# EAGLE design VSWR_meter1 (EAGLE 7.1.0)
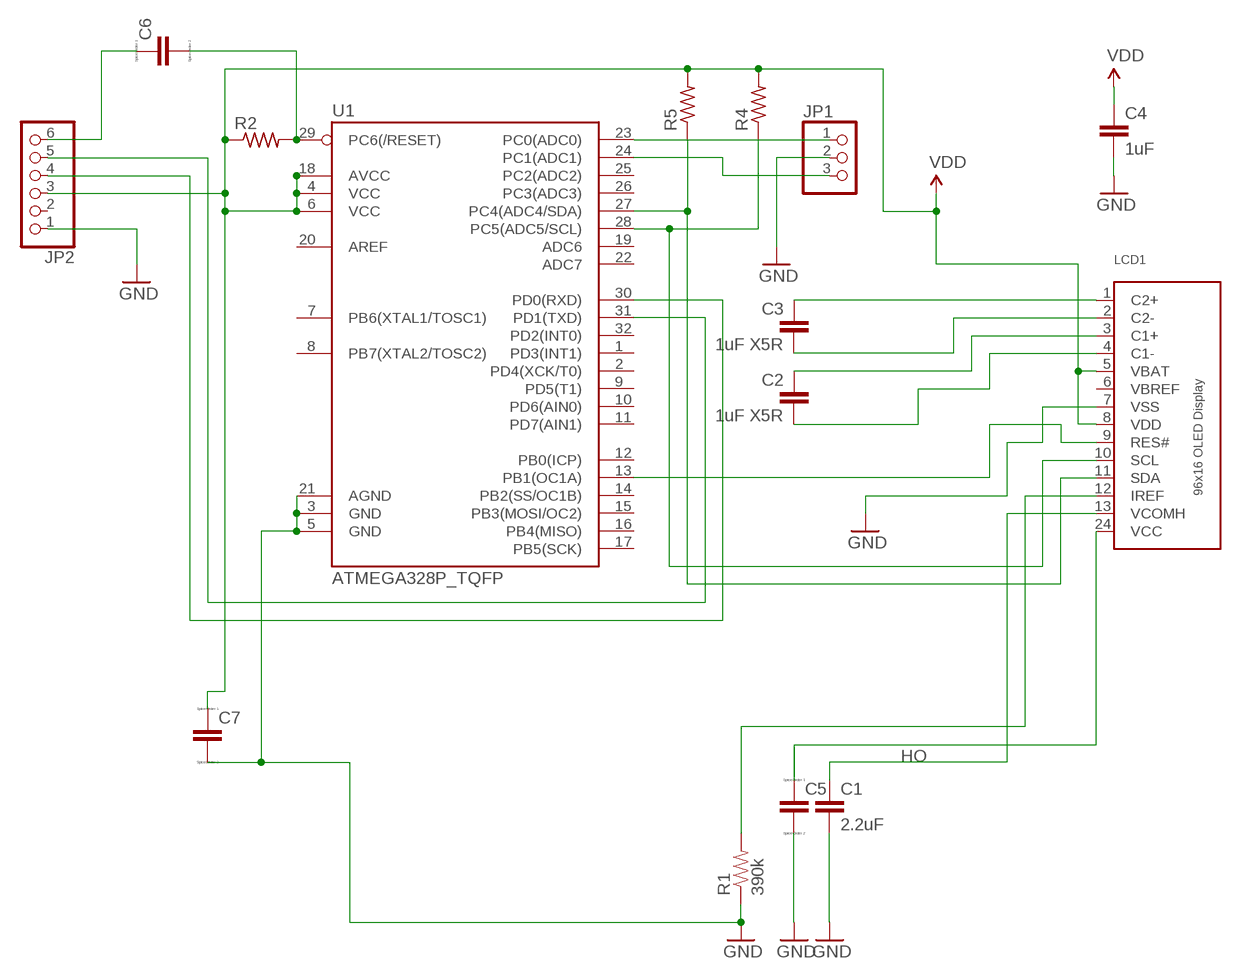
[diagram p0: schematic, sheet 1]

## Parts
C1  2.2uF  CAP0805  [0805]
C2  1uF X5R  CAP0805  [0805]
C3  1uF X5R  CAP0805  [0805]
C4  1uF  CAP0603-CAP  [0603-CAP]
C5  CC0603  [C0603]
C6  CC0603  [C0603]
C7  CC0603  [C0603]
JP1  HEADER-1X3  [1X03_OVAL]
JP2  HEADER-1X6  [1X06_OVAL]
LCD1  DISP_OLED_UG-9616GLBBG02  [UG-9616GLBBG02_0.65MM_WRAPAROUND]
R1  390k  RESISTOR0603-RES  [0603-RES]
R2  R-US_R0603  [R0603]
R4  R-US_R0603  [R0603]
R5  R-US_R0603  [R0603]
U1  ATMEGA328P_TQFP  [TQFP32-08]

## Nets
C1N: C2.2 LCD1.4(C1-)
C1P: C2.1 LCD1.3(C1+)
C2N: C3.2 LCD1.2(C2-)
C2P: C3.1 LCD1.1(C2+)
GND: C1.2 C4.2 C5.2 C7.2 JP1.2 JP2.1 LCD1.7(VSS) R1.1 U1.3(GND) U1.5(GND) U1.21(AGND)
HO: C1.1 LCD1.13(VCOMH)
IREF: LCD1.12(IREF) R1.2
N$1: LCD1.11(SDA) R5.1 U1.27(PC4(ADC4/SDA))
N$2: C6.2 R2.2 U1.29(PC6(/RESET))
N$3: LCD1.9(RES#) U1.13(PB1(OC1A))
N$4: C6.1 JP2.6
N$5: JP1.1 U1.23(PC0(ADC0))
N$6: LCD1.10(SCL) R4.1 U1.28(PC5(ADC5/SCL))
N$7: JP1.3 U1.24(PC1(ADC1))
N$8: JP2.5 U1.31(PD1(TXD))
N$9: JP2.4 U1.30(PD0(RXD))
VCOMH: C5.1 LCD1.24(VCC)
VDD: C4.1 C7.1 JP2.3 LCD1.5(VBAT) LCD1.8(VDD) R2.1 R4.2 R5.2 U1.4(VCC) U1.6(VCC) U1.18(AVCC)
Unconnected: JP2.2 LCD1.6(VBREF) U1.1(PD3(INT1)) U1.2(PD4(XCK/T0)) U1.7(PB6(XTAL1/TOSC1)) U1.8(PB7(XTAL2/TOSC2)) U1.9(PD5(T1)) U1.10(PD6(AIN0)) U1.11(PD7(AIN1)) U1.12(PB0(ICP)) U1.14(PB2(SS/OC1B)) U1.15(PB3(MOSI/OC2)) U1.16(PB4(MISO)) U1.17(PB5(SCK)) U1.19(ADC6) U1.20(AREF) U1.22(ADC7) U1.25(PC2(ADC2)) U1.26(PC3(ADC3)) U1.32(PD2(INT0))

## Library data of the parts
C1-C4 = SparkFun-Passives:CAP: Capacitor Standard 0603 ceramic capacitor, and 0.1" leaded capacitor.
C5-C7 = eagle-ltspice:C: CAPACITOR, European symbol; SPICEMODEL: NONE; SPICEPREFIX: C
JP1 = OLED_mod:HEADER-1X3: PIN HEADER
JP2 = OLED_mod:HEADER-1X6: PIN HEADER
LCD1 = OLED_mod:DISP_OLED_UG-9616GLBBG02: 96x16 0.84" I2C Mono OLED Display
R1 = SparkFun-Passives:RESISTOR: Resistor Basic schematic elements and footprints for 0603, 1206, and PTH resistors.
R2 R4 R5 = resistor:R-US_: RESISTOR, American symbol
U1 = SparkFun-DigitalIC:ATMEGA328P_TQFP; PROD_ID: IC-09069

## Board
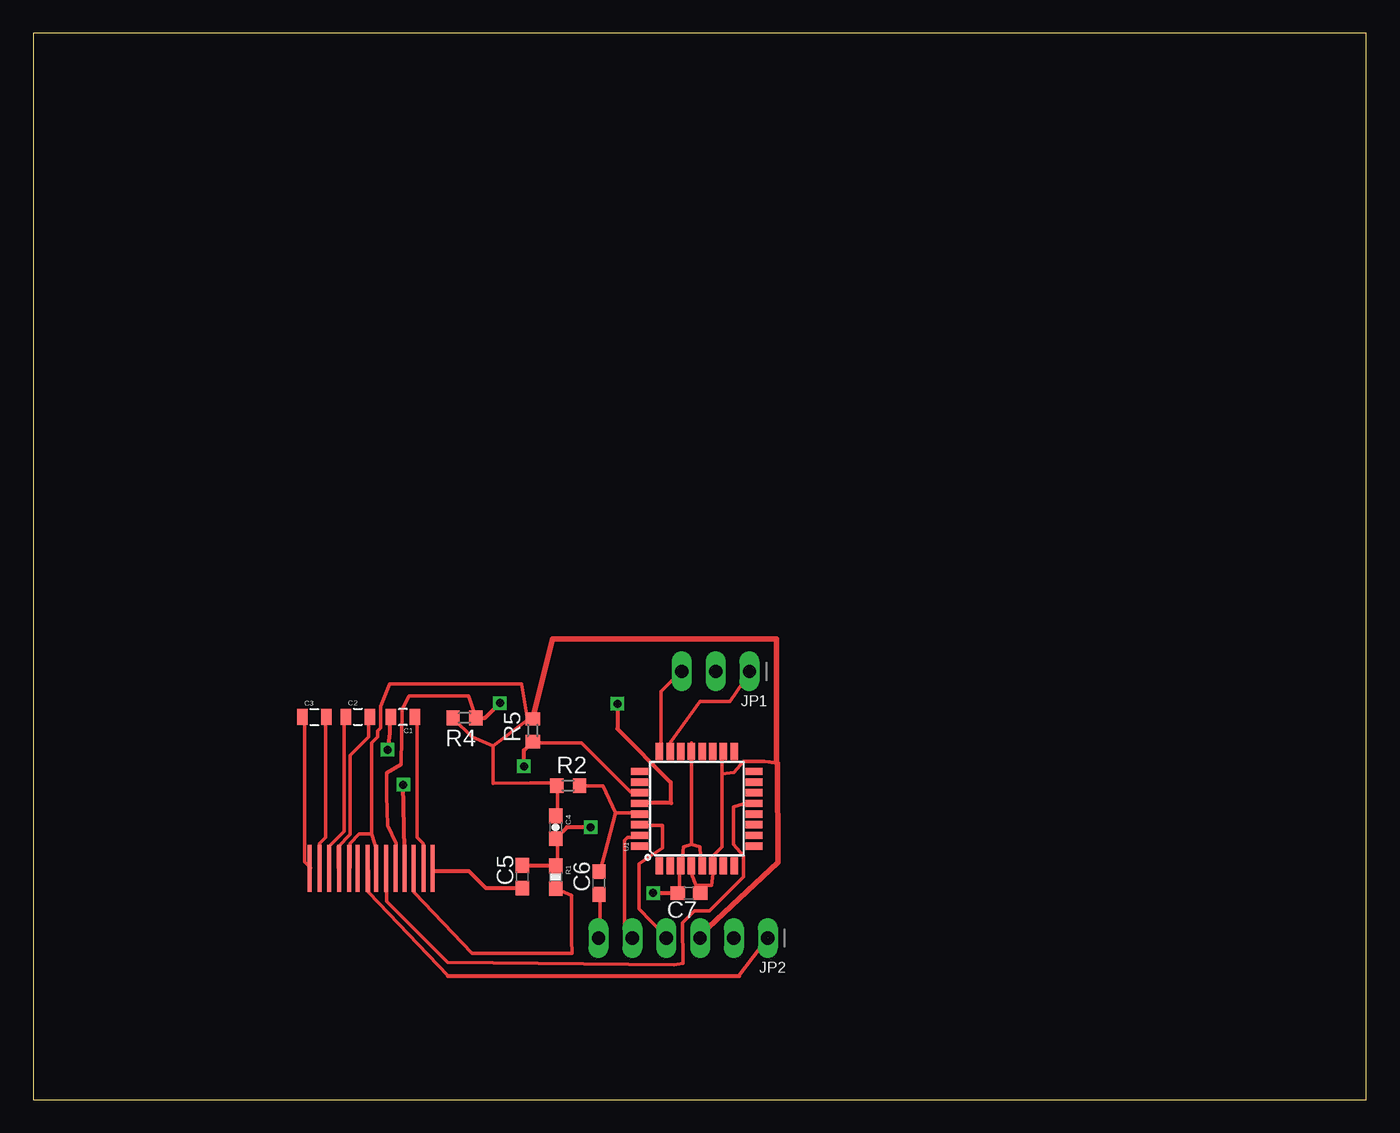
[diagram p1: board, top side]
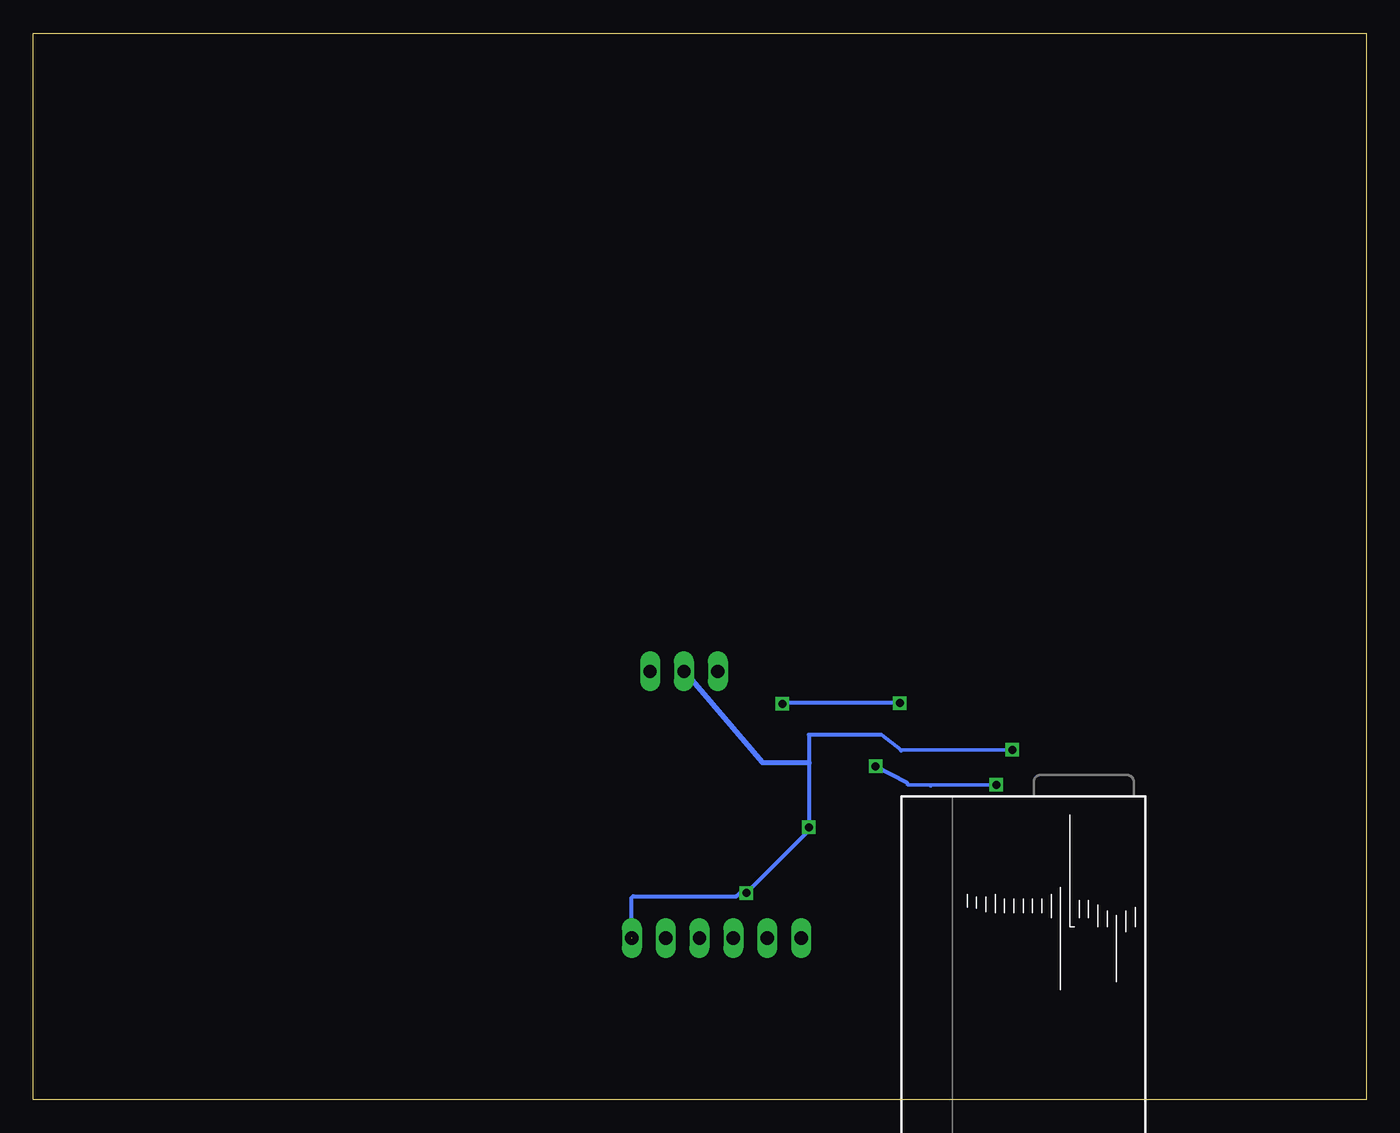
[diagram p2: board, bottom side, seen from below]

Size 100 x 80 mm. Coordinates in mm from the lower left corner, seen from the top.
Outline: 0,0 100,0 100,80 0,80 0,0
Copper layers (1*16): Top 0.035mm / dielectric 1.5mm / Bottom 0.035mm
Design rules "default": minimum track width 10mil, minimum drill 24mil, track to track 8mil, track to pad 8mil, pad to pad 8mil, via to via 8mil, smd to smd 8mil, copper to edge 40mil, drill to drill 8mil, minimum pad ring 10mil, minimum via ring 8mil, stop-mask expansion 4mil, vias tented up to drill 0mil, thermal gap 10mil

### Footprints (pad centres in the part's own frame; a part is rotated, then mirrored left to right if it is on the bottom)
0805 = smd 0.8 x 1.2: 1 -0.9,0; 2 0.9,0
0603-CAP = smd 1.1 x 1: 1 -0.85,0; 2 0.85,0
C0603 = smd 1.1 x 1: 1 -0.85,0; 2 0.85,0
1X03_OVAL = drill 1 long: 1 -2.54,0; 2 0,0; 3 2.54,0
1X06_OVAL = drill 1 long: 1 -6.35,0; 2 -3.81,0; 3 -1.27,0; 4 1.27,0; 5 3.81,0; 6 6.35,0
UG-9616GLBBG02_0.65MM_WRAPAROUND = smd 3.5 x 0.3 bottom: 1 -5.4,-0.463; 2 -5.4,0.275; 3 -5.4,1.012; 4 -5.4,1.75; 5 -5.4,2.487; 6 -5.4,3.138; 7 -5.4,3.875; 8 -5.4,4.525; 9 -5.4,5.263; 10 -5.4,6; 11 -5.4,6.65; 12 -5.4,7.338; 13 -5.4,8.088; 24 -5.4,8.775
0603-RES = smd 1.1 x 1: 1 -0.85,0; 2 0.85,0
R0603 = smd 1 x 1.1: 1 -0.85,0; 2 0.85,0
TQFP32-08 = smd 1.27 x 0.559: 1 -4.293,2.8; 2 -4.293,2; 3 -4.293,1.2; 4 -4.293,0.4; 5 -4.293,-0.4; 6 -4.293,-1.2; 7 -4.293,-2; 8 -4.293,-2.8; 17 4.293,-2.8; 18 4.293,-2; 19 4.293,-1.2; 20 4.293,-0.4; 21 4.293,0.4; 22 4.293,1.2; 23 4.293,2; 24 4.293,2.8 | smd 0.559 x 1.27: 9 -2.8,-4.293; 10 -2,-4.293; 11 -1.2,-4.293; 12 -0.4,-4.293; 13 0.4,-4.293; 14 1.2,-4.293; 15 2,-4.293; 16 2.8,-4.293; 25 2.8,4.293; 26 2,4.293; 27 1.2,4.293; 28 0.4,4.293; 29 -0.4,4.293; 30 -1.2,4.293; 31 -2,4.293; 32 -2.8,4.293

### Placement (x,y rotation side)
C1  27.73,28.69 180 top
C2  24.36,28.71 0 top
C3  21.09,28.69 0 top
C4  39.19,20.44 270 top
C5  36.69,16.73 90 top
C6  42.44,16.25 90 top
C7  49.19,15.5 180 top
JP1  51.19,32.12 180 top
JP2  48.75,12.12 180 top
LCD1  21.19,22.75 90 bottom
R1  39.19,16.69 270 top
R2  40.13,23.56 0 top
R4  32.34,28.64 180 top
R5  37.47,27.71 90 top
U1  49.77,21.82 90 top

### Tracks (layer width: path | path; a pad name or v marks a point on that pad's centre or on a via)
C1N
  Top 0.254: C2.2 25.15,28.57 25.15,27.2 23.77,25.83 23.77,19.89 22.86,18.97 22.86,17.37 LCD1.4
C1P
  Top 0.254: C2.1 23.32,28.57 23.32,20.12 22.17,18.97 22.17,17.37 LCD1.3
C2N
  Top 0.254: C3.2 21.95,28.57 21.95,19.66 21.49,19.2 21.49,17.37 LCD1.2
C2P
  Top 0.254: C3.1 20.34,28.57 20.34,17.83 20.8,17.37 LCD1.1
GND  (via drill 0.6)  (1 unrouted)
  Top 0.254: C7.2 48.46,15.54 48.46,17.37 U1.3 48.69,17.6 48.69,18.29 48.8,18.95 49.38,19.14 | 49.38,19.14 50.02,18.95 50.06,18.29 50.06,17.6 U1.5 | 49.38,19.14 49.38,26.06 U1.21 49.38,26.29 49.38,26.75 | C4.2 39.32,19.43 39.32,17.6 R1.1 | 26.75,28.57 C1.2 | 31.11,9.27 25.15,15.54 25.15,17.14 LCD1.7 | JP2.1 | v51.21,32.23 JP1.2
  Top 0.305: 26.75,28.57 26.75,27.5 v26.56,26.25 | v41.81,20.44 40.04,20.44 C4.2 | v46.5,15.5 C7.2 | 31.11,9.27 52.95,9.27 v55.12,12.12 | C5.2 39.16,17.57 R1.1
  Bottom 0.305: v26.56,26.25 34.88,26.19 36.38,27.38 41.81,27.38 41.81,25.25 v41.81,20.44 41.81,20.19 v46.5,15.5 47,15.5 47.25,15.25 55,15.25 55.12,15.12 v55.12,12.12
  Bottom 0.406: v51.21,32.23 45.31,25.31 41.81,25.25
HO
  Top 0.254: C1.1 28.8,28.57 28.8,19.66 29.26,19.2 29.26,17.37 LCD1.13
IREF
  Top 0.254: R1.2 39.32,15.77 40.38,15.32 40.38,13.14 40.38,11.99 40.4,10.95 32.92,10.95 28.57,15.54 28.57,17.14 LCD1.12
N$1  (via drill 0.6)
  Top 0.254: 37.72,26.75 41.15,26.75 44.81,23.09 45.26,23.09 U1.27 | 37.72,26.75 37.49,26.75 R5.1 37.72,26.75 | 27.89,17.14 LCD1.11
  Top 0.305: 27.89,17.14 27.88,17.14 v27.75,23.62 | v36.81,25 36.81,26.2 R5.1
  Bottom 0.305: v27.75,23.62 32.69,23.56 34.38,23.62 34.44,23.75 v36.81,25
N$2
  Top 0.254: 43.68,21.49 42.75,23.55 41.15,23.55 R2.2 | 43.68,21.49 45.26,21.49 U1.29 | 43.68,21.49 42.9,18.52 42.52,17.14 C6.2
N$3
  Top 0.254: U1.13 53.95,22.17 53.26,22.17 52.53,21.95 52.53,19.14 53.26,18.29 53.26,16.69 50.75,14.17 49.61,14.17 48.69,13.26 48.75,10.22 48.07,10.1 31.09,10.29 26.52,14.86 26.52,17.14 LCD1.9
N$4
  Top 0.254: C6.1 42.52,15.32 42.52,12.34 JP2.6
N$5
  Top 0.254: U1.23 47.78,26.29 47.78,26.75 50.02,29.86 52.27,29.86 53.72,32 JP1.1
N$6  (via drill 0.6)
  Top 0.254: R4.1 33.15,28.8 32.67,30.28 28.18,30.28 27.66,29.26 27.6,25.16 26.5,24.5 26.5,22.81 26.56,20.58 27.2,19.2 27.2,17.37 LCD1.10
  Top 0.305: R4.1 33.88,28.64 v35,29.75 | v43.81,29.69 43.81,27.81 47.81,23.81 47.81,22.31 47.88,22.25 45.52,22.25 U1.28
  Bottom 0.305: v35,29.75 43.75,29.75 v43.81,29.69
N$7
  Top 0.254: U1.24 47.09,26.29 47.09,30.63 48.46,32 JP1.3
N$8
  Top 0.254: U1.31 45.26,19.66 44.58,19.66 44.35,19.43 44.35,12.8 44.81,12.34 JP2.5
N$9
  Top 0.254: U1.30 45.49,20.57 46.18,20.57 47.2,20.55 47.2,18.87 45.43,17.66 45.43,14.3 47.32,12.34 JP2.4
VCOMH
  Top 0.254: 29.95,17.14 LCD1.24
  Top 0.305: 29.95,17.14 32.67,17.14 33.94,15.88 C5.1
VDD
  Top 0.254: 49.71,16.08 49.84,15.54 C7.1 | 49.71,16.08 49.38,16.92 49.38,17.37 U1.4 | 49.71,16.08 50.9,16.08 50.98,16.92 50.98,17.37 U1.6 50.98,17.6 50.98,18.29 51.66,18.97 51.66,24.42 | 51.66,24.42 51.66,26.06 U1.18 | 54.86,25.38 55.84,25.21 | 54.86,25.38 53.26,25.38 52.56,24.54 51.66,24.42 | 50.06,12.34 JP2.3 | 25.38,19.93 24.44,19.93 23.77,19.2 23.77,17.37 LCD1.5 | 25.38,19.93 25.6,19.2 25.73,18.81 LCD1.8 | C4.1 39.32,21.49 39.32,23.55 R2.1 39.09,23.77 37.26,23.77 34.49,23.73 34.49,26.52 | 34.49,26.52 32.92,27.2 31.55,28.57 R4.2 | 37.08,28.47 37.26,28.35 R5.2 37.49,28.57 | 37.08,28.47 34.49,26.52 | 25.38,19.93 25.38,26.75 25.83,27.2 25.83,27.66 26.06,27.89 26.06,29.49 26.75,31.18 36.62,31.18 37.08,28.47 | 55.74,25.3 54.86,25.38
  Top 0.406: 50.06,12.34 55.88,17.81 55.84,25.21 | 55.74,25.3 55.75,34.56 38.94,34.56 R5.2